# Altium schematic sheet Sheet1.SchDoc
size A4
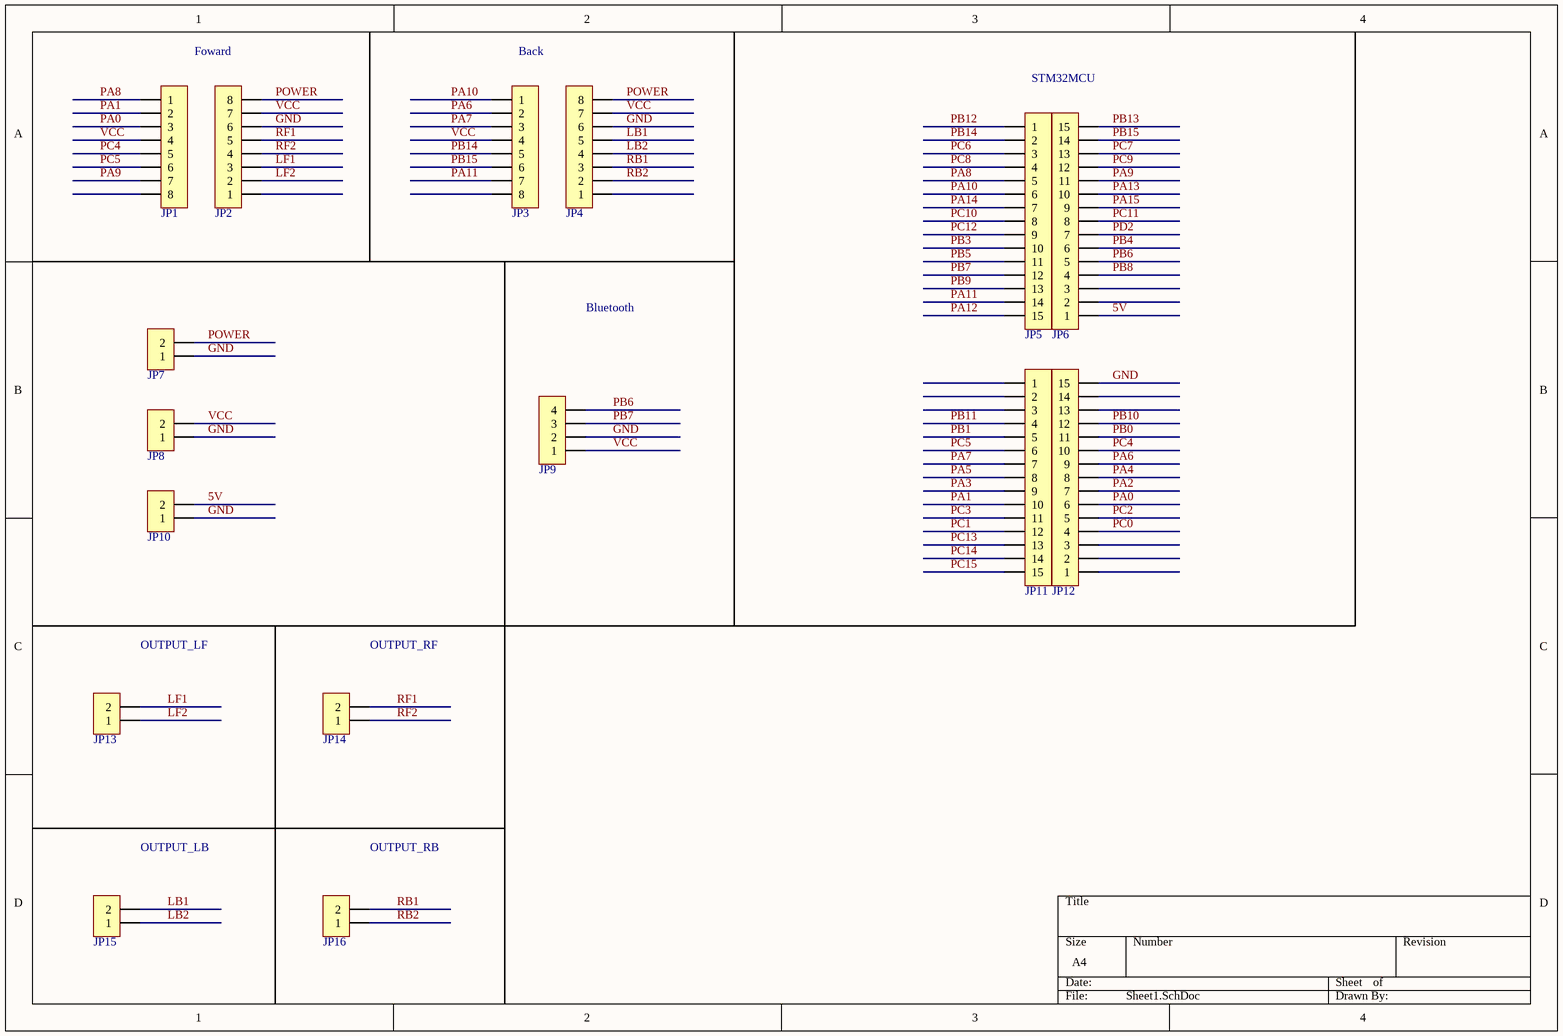
[diagram p0: Sheet1.SchDoc]

## Parts
JP1  HDR-1X8  [Fe-HDR1X8/2.54-S]  (value not drawn)
JP2  HDR-1X8  [Fe-HDR1X8/2.54-S]  (value not drawn)
JP3  HDR-1X8  [Fe-HDR1X8/2.54-S]  (value not drawn)
JP4  HDR-1X8  [Fe-HDR1X8/2.54-S]  (value not drawn)
JP5  HDR-1X15  [Fe-HDR1X15/2.54-S]  (value not drawn)
JP6  HDR-1X15  [Fe-HDR1X15/2.54-S]  (value not drawn)
JP7  HDR-1X2  [Fe-HDR1X2/2.54-S]  (value not drawn)
JP8  HDR-1X2  [Fe-HDR1X2/2.54-S]  (value not drawn)
JP9  HDR-1X4  [Fe-HDR1X4/2.54-S]  (value not drawn)
JP10  HDR-1X2  [Fe-HDR1X2/2.54-S]  (value not drawn)
JP11  HDR-1X15  [Fe-HDR1X15/2.54-S]  (value not drawn)
JP12  HDR-1X15  [Fe-HDR1X15/2.54-S]  (value not drawn)
JP13  HDR-1X2  [Fe-HDR1X2/2.54-S]  (value not drawn)
JP14  HDR-1X2  [Fe-HDR1X2/2.54-S]  (value not drawn)
JP15  HDR-1X2  [Fe-HDR1X2/2.54-S]  (value not drawn)
JP16  HDR-1X2  [Fe-HDR1X2/2.54-S]  (value not drawn)

## Nets
5V: JP6.1 JP10.2
GND: JP2.6 JP4.6 JP7.1 JP8.1 JP9.2 JP10.1 JP12.15
LB1: JP4.5 JP15.2
LB2: JP4.4 JP15.1
LF1: JP2.3 JP13.2
LF2: JP2.2 JP13.1
PA0: JP1.3 JP12.6
PA1: JP1.2 JP11.10
PA2: JP12.7
PA3: JP11.9
PA4: JP12.8
PA5: JP11.8
PA6: JP3.2 JP12.9
PA7: JP3.3 JP11.7
PA8: JP1.1 JP5.5
PA9: JP1.7 JP6.11
PA10: JP3.1 JP5.6
PA11: JP3.7 JP5.14
PA12: JP5.15
PA13: JP6.10
PA14: JP5.7
PA15: JP6.9
PB0: JP12.11
PB1: JP11.5
PB3: JP5.10
PB4: JP6.6
PB5: JP5.11
PB6: JP6.5 JP9.4
PB7: JP5.12 JP9.3
PB8: JP6.4
PB9: JP5.13
PB10: JP12.12
PB11: JP11.4
PB12: JP5.1
PB13: JP6.15
PB14: JP3.5 JP5.2
PB15: JP3.6 JP6.14
PC0: JP12.4
PC1: JP11.12
PC2: JP12.5
PC3: JP11.11
PC4: JP1.5 JP12.10
PC5: JP1.6 JP11.6
PC6: JP5.3
PC7: JP6.13
PC8: JP5.4
PC9: JP6.12
PC10: JP5.8
PC11: JP6.8
PC12: JP5.9
PC13: JP11.13
PC14: JP11.14
PC15: JP11.15
PD2: JP6.7
POWER: JP2.8 JP4.8 JP7.2
RB1: JP4.3 JP16.2
RB2: JP4.2 JP16.1
RF1: JP2.5 JP14.2
RF2: JP2.4 JP14.1
VCC: JP1.4 JP2.7 JP3.4 JP4.7 JP8.2 JP9.1

Not connected (* = marked no-connect by the designer): JP1 8; JP2 1; JP3 8; JP4 1; JP6 2 3; JP11 1 2 3; JP12 1 2 3 13 14

## Notes on the sheet
- Foward
- Back
- STM32MCU
- Bluetooth
- OUTPUT_LF
- OUTPUT_RF
- OUTPUT_LB
- OUTPUT_RB

## Library data of the parts
JP1-JP4 = Header 8: 8P接插件; 版权归属: 源创客; BOM名称: 8P接插件; 学习资源: www.ooocke.com
JP5 JP6 JP11 JP12 = Header 15: 15P接插件; 版权归属: 源创客; BOM名称: 15P接插件; 学习资源: www.ooocke.com
JP7 JP8 JP10 JP13-JP16 = Header 2: 2P接插件; 版权归属: 源创客; BOM名称: 2P接插件; 学习资源: www.ooocke.com
JP9 = Header 4: 4P接插件; 版权归属: 源创客; BOM名称: 4P接插件; 学习资源: www.ooocke.com